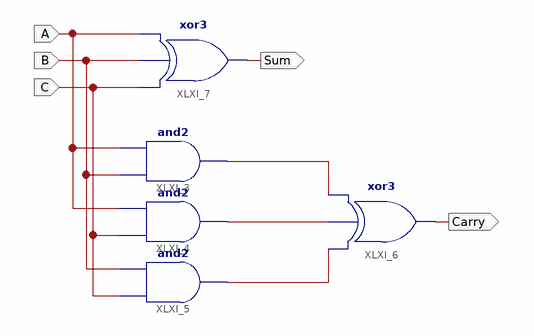
[diagram p0: schematic sheet 1]
// Xilinx ISE schematic FullAdder.sch (spartan3e) as structural Verilog: 5 symbols, 5 ports
module FullAdder (
  input  A,
  input  B,
  input  C,
  output Sum,
  output Carry
);

  wire XLXN_10, XLXN_11, XLXN_12;

  and XLXI_3 (XLXN_10, B, A);
  and XLXI_4 (XLXN_11, C, A);
  and XLXI_5 (XLXN_12, C, B);
  xor XLXI_6 (Carry, XLXN_12, XLXN_11, XLXN_10);
  xor XLXI_7 (Sum, C, B, A);
endmodule
